# EAGLE design sensor-hub-fr-fl (EAGLE 9.6.2)
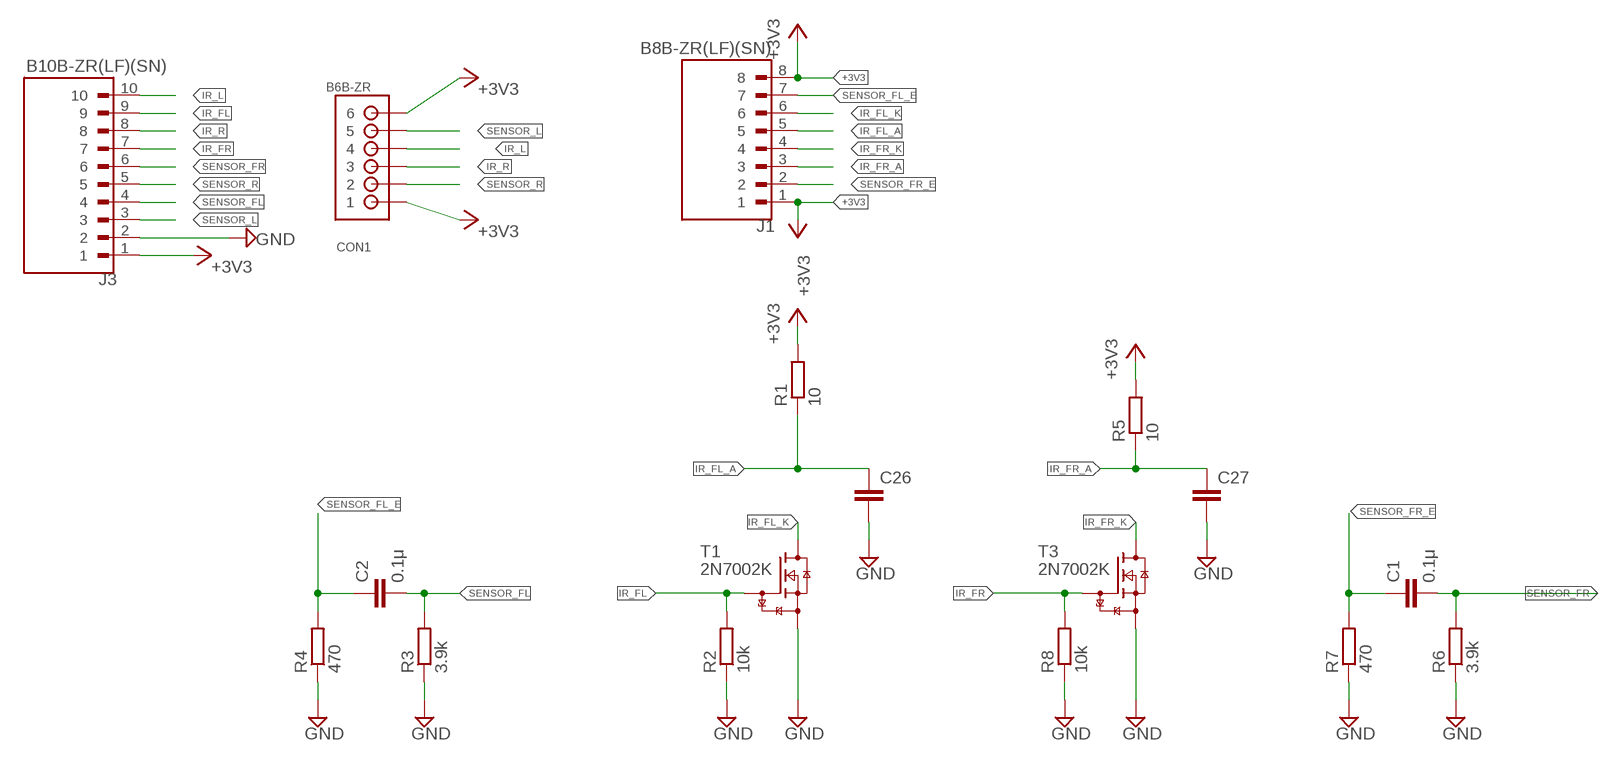
[diagram p0: schematic, sheet 1]

## Parts
C1  0.1μ  C-EUC0603  [C0603]
C2  0.1μ  C-EUC0603  [C0603]
C26  C-EUC1206  [C1206]
C27  C-EUC1206  [C1206]
CON1  B6B-ZR  [B6B-ZR]
J1  B8B-ZR(LF)(SN)  [JST_B8B-ZR(LF)(SN)]
J3  B10B-ZR(LF)(SN)  [JST_B10B-ZR(LF)(SN)]
R1  10  R-EU_R0603  [R0603]
R2  10k  R-EU_R0603  [R0603]
R3  3.9k  R-EU_R0603  [R0603]
R4  470  R-EU_R0603  [R0603]
R5  10  R-EU_R0603  [R0603]
R6  3.9k  R-EU_R0603  [R0603]
R7  470  R-EU_R0603  [R0603]
R8  10k  R-EU_R0603  [R0603]
T1  2N7002K  [SOT23]
T3  2N7002K  [SOT23]

## Nets
+3V3 [power]: CON1.1 CON1.6 J1.1 J1.8 J3.1 R1.2 R5.2
GND [motor]: C26.2 C27.2 J3.2 R2.1 R3.1 R4.1 R6.1 R7.1 R8.1 T1.2(S) T3.2(S)
IR_FL: J3.9 R2.2 T1.1(G)
IR_FL_A: C26.1 J1.5 R1.1
IR_FL_K: J1.6 T1.3(D)
IR_FR: J3.7 R8.2 T3.1(G)
IR_FR_A: C27.1 J1.3 R5.1
IR_FR_K: J1.4 T3.3(D)
IR_L: CON1.4 J3.10
IR_R: CON1.3 J3.8
SENSOR_FL: C2.2 J3.4 R3.2
SENSOR_FL_E: C2.1 J1.7 R4.2
SENSOR_FR: C1.2 J3.6 R6.2
SENSOR_FR_E: C1.1 J1.2 R7.2
SENSOR_L: CON1.5 J3.3
SENSOR_R: CON1.2 J3.5

## Library data of the parts
C1 C2 C26 C27 = rcl:C-EU: CAPACITOR, European symbol; SPICEPREFIX: C
CON1 = zh:B6B-ZR: JST-ZH Connector 6 pol, 1.5mm pitch Package: B6B-ZR Source: http://www.jst-mfg.com/product/pdf/eng/eZH.pdf
J1 = B8B-ZR_LF__SN_:B8B-ZR(LF)(SN): Check availability <https://pricing.snapeda.com/parts/B8B-ZR%20%28LF%29%28SN%29/JST/view-part?ref=eda>; AVAILABILITY: In Stock; CHECK_PRICES: https://www.snapeda.com/parts/B8B-ZR%20(LF)(SN)/JST/view-part/?ref=eda; DESCRIPTION: Wire-To-Board Connector, Top Entry, ZH Series, Through Hole, Header, 8, 1.5 mm, Tin Plated Contacts RoHS Compliant: Yes; MF: JST; MP: B8B-ZR (LF)(SN); PACKAGE: None; PRICE: None; SNAPEDA_LINK: https://www.snapeda.com/parts/B8B-ZR%20(LF)(SN)/JST/view-part/?ref=snap
J3 = B10B-ZR_LF__SN_:B10B-ZR(LF)(SN): Check availability <https://pricing.snapeda.com/parts/B10B-ZR%28LF%29%28SN%29/JST%20Sales%20America%20Inc./view-part?ref=eda>; AVAILABILITY: In Stock; CHECK_PRICES: https://www.snapeda.com/parts/B10B-ZR(LF)(SN)/JST/view-part/?ref=eda; DESCRIPTION: Connector Header Through Hole 10 position 0.059 (1.50mm); MF: JST Sales America Inc.; MP: B10B-ZR(LF)(SN); PACKAGE: None; PRICE: None; SNAPEDA_LINK: https://www.snapeda.com/parts/B10B-ZR(LF)(SN)/JST/view-part/?ref=snap
R1-R8 = rcl:R-EU_: RESISTOR, European symbol; SPICEPREFIX: R
T1 T3 = nxp_60:2N7002K: N-channel TrenchMOS FET N-channel enhancement mode Field-Effect Transistor (FET) in a plastic package using TrenchMOS technology. AAL Eindhoven MK

## Net classes
1 power: width 0.152 mm, clearance 0.205 mm to class 0, clearance 0.205 mm
2 motor: width 0.152 mm, clearance 0.205 mm to class 0, clearance 0.205 mm to class 1, clearance 0.205 mm

## Board
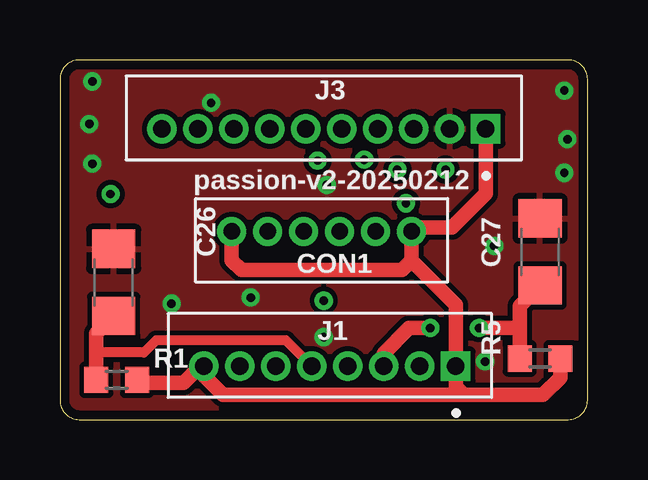
[diagram p1: board, top side]
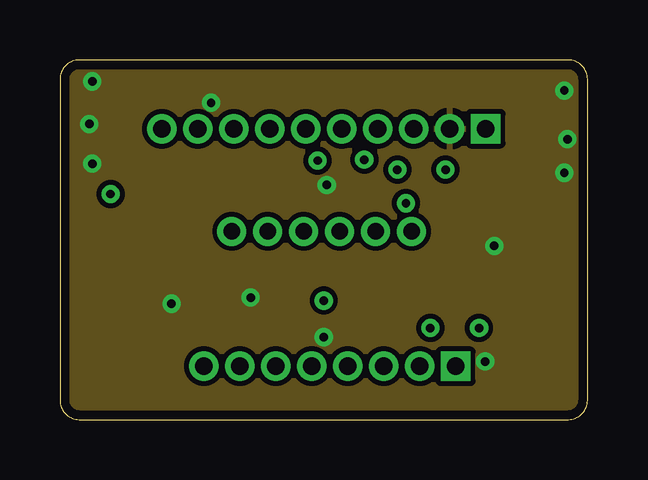
[diagram p2: board, inner layer Route2]
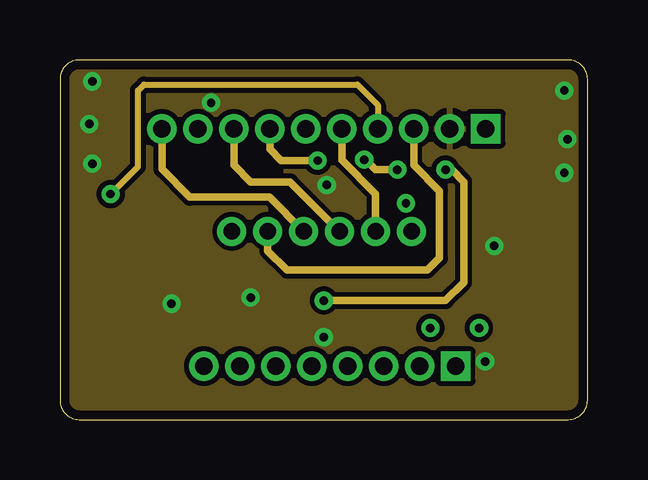
[diagram p3: board, inner layer Route15]
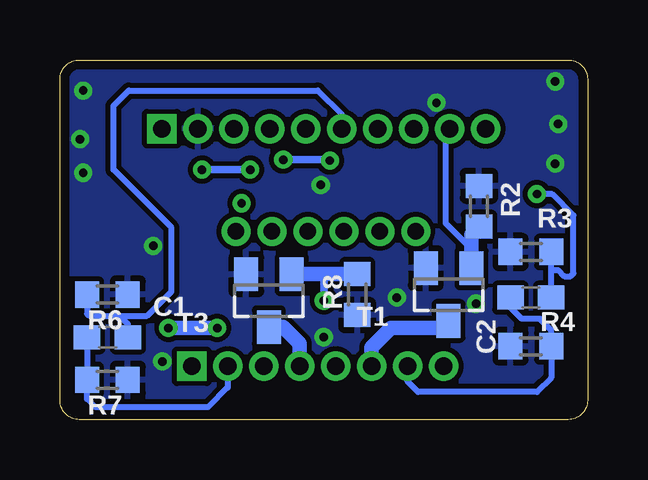
[diagram p4: board, bottom side, seen from below]

Size 22 x 15 mm. Coordinates in mm from the lower left corner, seen from the top.
Outline: 22,14.2 arc90 21.2,15 0.8,15 arc90 0,14.2 0,0.8 arc90 0.8,0 21.2,0 arc90 22,0.8 22,14.2
Copper layers (1+2*15+16): Top 0.035mm / dielectric 1.5mm / Route2 0.035mm / dielectric 0.15mm / Route15 0.035mm / dielectric 0.2mm / Bottom 0.035mm
Design rules "default *": minimum track width 6mil, minimum drill 0.2mm, track to track 6mil, track to pad 6mil, pad to pad 6mil, via to via 6mil, smd to smd 6mil, copper to edge 15mil, drill to drill 6mil, minimum pad ring 10mil, minimum via ring 8mil, stop-mask expansion 4mil, vias tented up to drill 100mil, thermal gap 10mil

### Footprints (pad centres in the part's own frame; a part is rotated, then mirrored left to right if it is on the bottom)
C0603 = smd 1.1 x 1: 1 -0.85,0; 2 0.85,0
C1206 = smd 1.6 x 1.8: 1 -1.4,0; 2 1.4,0
B6B-ZR = drill 0.7: 1 9,-1.3; 2 7.5,-1.3; 3 6,-1.3; 4 4.5,-1.3; 5 3,-1.3; 6 1.5,-1.3
JST_B8B-ZR(LF)(SN) = drill 0.73 square: 1 5.25,-0.45 | drill 0.73: 2 3.75,-0.45; 3 2.25,-0.45; 4 0.75,-0.45; 5 -0.75,-0.45; 6 -2.25,-0.45; 7 -3.75,-0.45; 8 -5.25,-0.45
JST_B10B-ZR(LF)(SN) = drill 0.73 square: 1 6.75,-0.45 | drill 0.73: 2 5.25,-0.45; 3 3.75,-0.45; 4 2.25,-0.45; 5 0.75,-0.45; 6 -0.75,-0.45; 7 -2.25,-0.45; 8 -3.75,-0.45; 9 -5.25,-0.45; 10 -6.75,-0.45
R0603 = smd 1 x 1.1: 1 -0.85,0; 2 0.85,0
SOT23 = smd 1 x 1.4: 1 -0.95,-1.1; 2 0.95,-1.1; 3 0,1.1

### Placement (x,y rotation side)
C1  20.02,3.44 0 bottom
C2  2.36,5.09 0 bottom
C26  2.24,5.72 90 top
C27  20.02,6.99 90 top
CON1  5.67,9.15 0 top
J1  11.25,2.67 0 top
J3  11,12.58 0 top
R1  2.36,1.66 0 top
R2  4.52,8.9 270 bottom
R3  2.36,6.99 0 bottom
R4  2.36,3.05 0 bottom
R5  20.02,2.55 0 top
R6  20.02,5.21 180 bottom
R7  20.02,1.66 180 bottom
R8  9.6,5.21 90 bottom
T1  5.79,5.21 180 bottom
T3  13.29,4.96 180 bottom

### Tracks (layer width: path | path; a pad name or v marks a point on that pad's centre or on a via)
+3V3
  Top 0.61: 14.67,6.63 CON1.1 14.82,8.01 16.33,8.01 17.75,9.42 J3.1 | 14.67,6.63 16.5,4.79 J1.1 16.5,1.36 16.84,1.02 | CON1.6 7.17,6.63 7.57,6.23 14.27,6.23 14.67,6.63 | R5.2 20.87,1.75 20.14,1.02 17.35,1.02 16.84,1.02 | R1.2 3.34,1.53 5.16,1.53 5.85,2.22 J1.8 6,1.83 6.81,1.02 16.84,1.02
GND  (via drill 0.35)
  other vias: 4.65,4.83 11,3.44 7.95,5.09 18.11,7.25 21.03,10.29 21.16,11.69 21.03,13.72 11.13,9.79 6.3,13.21 1.35,10.68 1.22,12.33 1.35,14.1 17.73,2.42
  pour Top: -2.97,16.39 -2.97,-1.39 23.7,-1.39 23.7,16.39
  pour Route2: -5.51,17.66 -5.51,-2.66 -4.24,-3.93 23.7,-3.93 24.97,-2.66 24.97,17.66 23.7,18.93 22.43,17.66
  pour Route15: 12.27,20.2 -5.51,20.2 -9.32,16.39 -9.32,-2.66 -5.51,-6.47 23.7,-6.47 27.51,-2.66 27.51,18.93 27.51,20.2 26.24,21.47 17.35,21.47 16.08,20.2
  pour Bottom: 13.54,24.01 -6.78,24.01 -14.4,16.39 -14.4,-2.66 -9.32,-7.74 -8.05,-9.01 28.78,-9.01 31.32,-6.47 31.32,24.01
IR_FL
  Bottom 0.254: J3.9 5.92,11.96 5.92,8.2 4.84,7.12
  Bottom 0.61: R2.2 4.84,7.73 4.84,7.12 T1.1
IR_FL_A
  Top 0.406: J1.5 9.42,3.31 4.01,3.31 3.51,2.8 1.51,2.8
  Top 0.61: R1.1 1.51,2.8 1.51,3.6 C26.1
IR_FL_K
  Bottom 0.61: J1.6 9,3.02 8.21,3.82 6.09,3.82 T1.3
IR_FR  (via drill 0.35)
  Route15 0.305: v11,4.96 16.08,4.96 16.84,5.72 16.84,9.91 16.33,10.42 v16.08,10.42 | v14.07,10.42 13.16,10.42 12.74,10.84 v12.69,10.84 | v10.75,10.8 9.22,10.8 8.75,11.27 J3.7
  Bottom 0.305: 11,6.06 v11,4.96 | v16.08,10.42 v14.07,10.42 | v12.69,10.84 10.78,10.84 v10.75,10.8
  Bottom 0.61: T3.1 11,6.06 R8.2
IR_FR_A  (via drill 0.35)
  Top 0.61: R5.1 19.17,3.69 | 19.17,3.69 19.17,4.74 C27.1 | J1.3 13.5,2.76 14.56,3.82 v15.45,3.82 | v17.48,3.82 19.04,3.82 19.17,3.69
  Bottom 0.61: v15.45,3.82 v17.48,3.82
IR_FR_K
  Bottom 0.61: J1.4 12,3.17 12.69,3.86 T3.3
IR_L
  Route15 0.305: CON1.4 8.74,9.28 5.41,9.28 4.25,10.44 J3.10
IR_R
  Route15 0.305: CON1.3 9.6,9.91 7.95,9.91 7.25,10.62 J3.8
N$10  (via drill 0.35)
  other vias: 14.43,9.02
SENSOR_FL  (via drill 0.35)
  Route15 0.254: v2.11,9.4 3.25,10.55 3.25,13.72 3.51,13.98 12.4,13.98 13.25,13.12 J3.4
  Bottom 0.254: C2.2 1.51,6.23 | 1.51,6.23 R3.2 | 1.51,6.23 1.22,6.23 0.97,5.98 0.71,5.98 0.59,6.1 0.59,8.52 1.47,9.4 v2.11,9.4
SENSOR_FL_E
  Bottom 0.254: J1.7 7.5,1.59 7.06,1.15 2.11,1.15 1.51,1.75 R4.2 1.51,3.73 1.79,4.01 1.86,4.07 1.98,4.2 2.74,4.2 3.21,4.67 C2.1
SENSOR_FR
  Bottom 0.254: R6.2 20.87,4.41 20.78,4.33 19.51,4.33 | C1.2 19.17,3.98 19.51,4.33 | 19.51,4.33 18.37,4.33 17.35,5.34 17.35,8.01 19.76,10.42 19.76,13.09 19.13,13.72 11.25,13.72 10.25,12.72 J3.6
SENSOR_FR_E
  Bottom 0.254: J1.2 15,1.34 15.83,0.51 20.52,0.51 20.87,0.86 R7.2 C1.1
SENSOR_L
  Route15 0.305: CON1.5 8.67,7.04 9.48,6.23 9.73,6.23 15.32,6.23 15.83,6.74 15.83,9.53 14.75,10.61 J3.3
SENSOR_R
  Route15 0.305: CON1.2 13.17,9.4 11.75,10.81 J3.5

### Text on the board
tPlace: passion-v2-20250212